# Altium schematic sheet 7_can_rc_i2c_analog.SchDoc: CAN/RCIN/I2C/Analog inputs
size A3; SheetNumber: 7; SheetTotal: 8
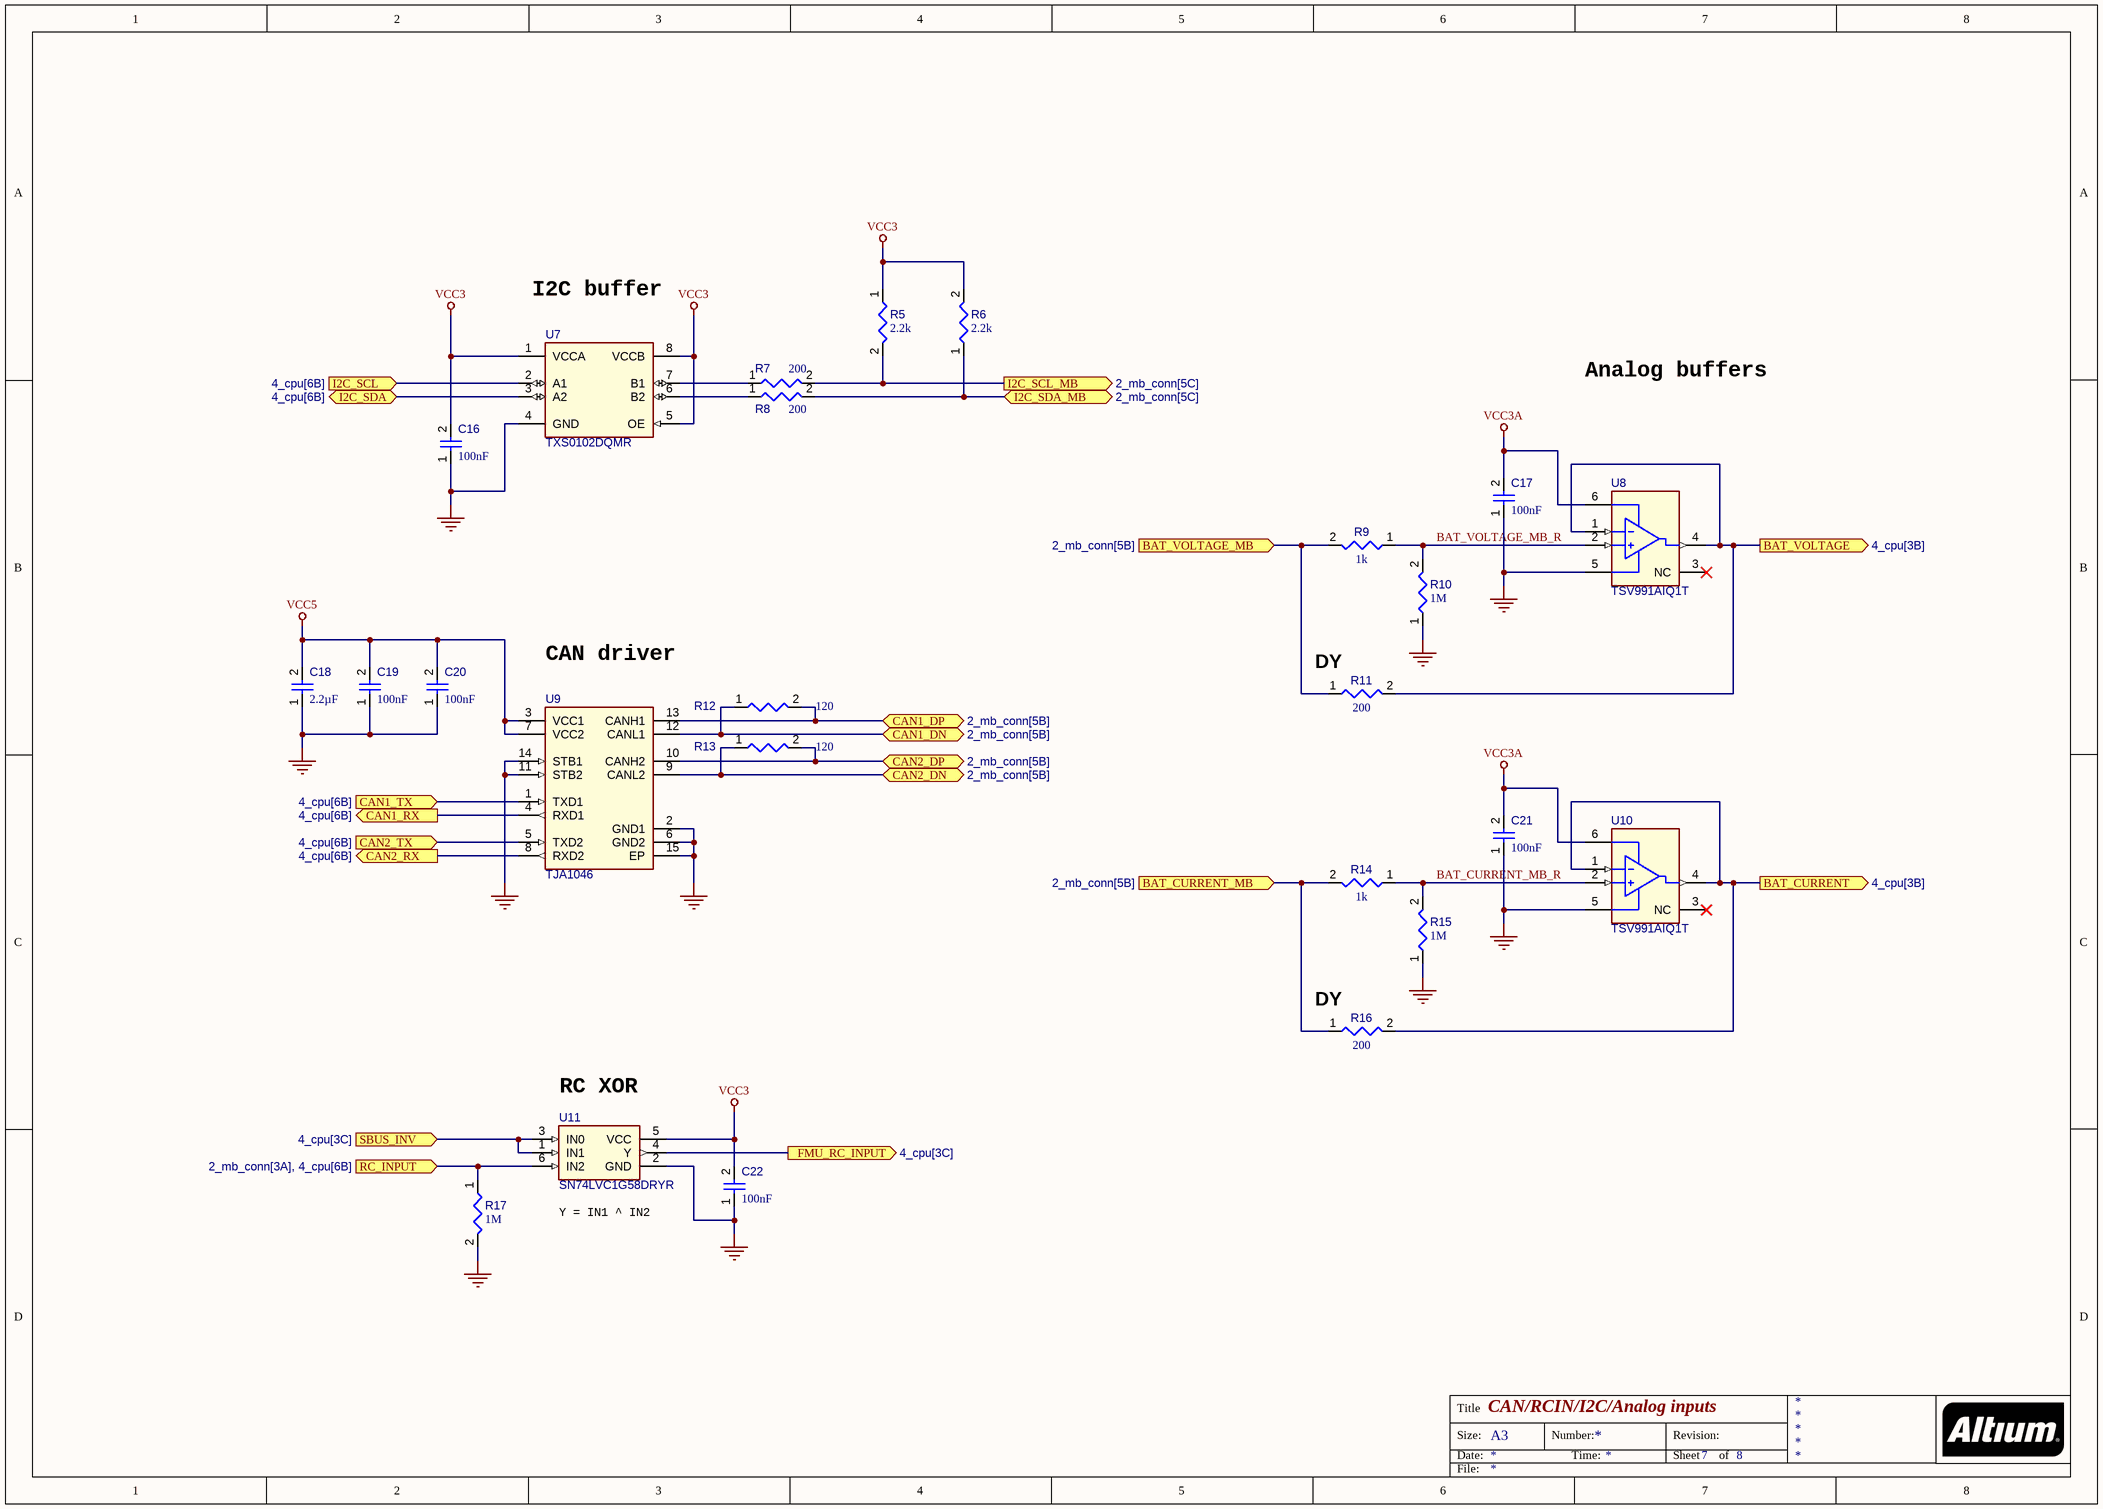
[diagram p0: 7_can_rc_i2c_analog.SchDoc]

## Parts
C16  value 100nF  [CAPC0402(1005)60_L]  (hidden comment: Capacitor 100nF +/-20% 10V 0402)
C17  value 100nF  [CAPC0402(1005)60_L]  (hidden comment: Capacitor 100nF +/-20% 10V 0402)
C18  value 2.2µF  [CAPC0402(1005)60_L]  (hidden comment: Capacitor 2,2µF +/-20% 10V 0402)
C19  value 100nF  [CAPC0402(1005)60_L]  (hidden comment: Capacitor 100nF +/-20% 10V 0402)
C20  value 100nF  [CAPC0402(1005)60_L]  (hidden comment: Capacitor 100nF +/-20% 10V 0402)
C21  value 100nF  [CAPC0402(1005)60_L]  (hidden comment: Capacitor 100nF +/-20% 10V 0402)
C22  value 100nF  [CAPC0402(1005)60_L]  (hidden comment: Capacitor 100nF +/-20% 10V 0402)
R5  value 2.2k  [RESC0402(1005)_L]  (hidden comment: Resistor 2K2  +/-5 % 0402 63 mW)
R6  value 2.2k  [RESC0402(1005)_L]  (hidden comment: Resistor 2K2  +/-5 % 0402 63 mW)
R7  value 200  [RESC0402(1005)_L]  (hidden comment: Resistor 200R +/-5 % 0402 63 mW)
R8  value 200  [RESC0402(1005)_L]  (hidden comment: Resistor 200R +/-5 % 0402 63 mW)
R9  value 1k  [RESC0402(1005)_L]  (hidden comment: Resistor 1K +/-5 % 0402 63 mW)
R10  value 1M  [RESC0402(1005)_L]  (hidden comment: Resistor 1M +/-5 % 0402 63 mW)
R11  value 200  [RESC0402(1005)_L]  (hidden comment: Resistor 200R +/-5 % 0402 63 mW)
R12  value 120  [RESC0603(1608)_L]  (hidden comment: Resistor 120R +/-5 % 0603 0.1 W)
R13  value 120  [RESC0603(1608)_L]  (hidden comment: Resistor 120R +/-5 % 0603 0.1 W)
R14  value 1k  [RESC0402(1005)_L]  (hidden comment: Resistor 1K +/-5 % 0402 63 mW)
R15  value 1M  [RESC0402(1005)_L]  (hidden comment: Resistor 1M +/-5 % 0402 63 mW)
R16  value 200  [RESC0402(1005)_L]  (hidden comment: Resistor 200R +/-5 % 0402 63 mW)
R17  value 1M  [RESC0402(1005)_L]  (hidden comment: Resistor 1M +/-5 % 0402 63 mW)
U7  TXS0102DQMR  [DQM]
U8  TSV991AIQ1T  [STM-DFN-8_V]
U9  TJA1046  [NXP-SOT1086-2_L]
U10  TSV991AIQ1T  [STM-DFN-8_V]
U11  SN74LVC1G58DRYR  [DRY0006A_V]

## Ports
BAT_CURRENT (out, see 4_cpu[3B]), BAT_CURRENT_MB (in, see 2_mb_conn[5B]), BAT_VOLTAGE (out, see 4_cpu[3B]), BAT_VOLTAGE_MB (in, see 2_mb_conn[5B]), CAN1_DN (bidir, see 2_mb_conn[5B]), CAN1_DP (bidir, see 2_mb_conn[5B]), CAN1_RX (out, see 4_cpu[6B]), CAN1_TX (in, see 4_cpu[6B]), CAN2_DN (bidir, see 2_mb_conn[5B]), CAN2_DP (bidir, see 2_mb_conn[5B]), CAN2_RX (out, see 4_cpu[6B]), CAN2_TX (in, see 4_cpu[6B]), FMU_RC_INPUT (out, see 4_cpu[3C]), I2C_SCL (in, see 4_cpu[6B]), I2C_SCL_MB (out, see 2_mb_conn[5C]), I2C_SDA (bidir, see 4_cpu[6B]), I2C_SDA_MB (bidir, see 2_mb_conn[5C]), RC_INPUT (in, see 2_mb_conn[3A], 4_cpu[6B]), SBUS_INV (in, see 4_cpu[3C])

## Nets
GND: C16.1 C17.1 C18.1 C19.1 C20.1 C21.1 C22.1 R10.1 R15.1 R17.2 U7.4(GND) U8.5(VCC-) U9.2(GND1) U9.6(GND2) U9.11(STB2) U9.14(STB1) U9.15(EP) U10.5(VCC-) U11.2(GND)
VCC3: C16.2 C22.2 R5.1 R6.2 U7.1(VCCA) U7.5(OE) U7.8(VCCB) U11.5(VCC)
VCC3A: C17.2 C21.2 U8.6(VCC+) U10.6(VCC+)
VCC5: C18.2 C19.2 C20.2 U9.3(VCC1) U9.7(VCC2)
BAT_CURRENT: R16.2 U10.1(IN-) U10.4(OUT) ; port BAT_CURRENT
BAT_CURRENT_MB: R14.2 R16.1 ; port BAT_CURRENT_MB
BAT_CURRENT_MB_R: R14.1 R15.2 U10.2(IN+)
BAT_VOLTAGE: R11.2 U8.1(IN-) U8.4(OUT) ; port BAT_VOLTAGE
BAT_VOLTAGE_MB: R9.2 R11.1 ; port BAT_VOLTAGE_MB
BAT_VOLTAGE_MB_R: R9.1 R10.2 U8.2(IN+)
CAN1_DN: R12.1 U9.12(CANL1) ; port CAN1_DN
CAN1_DP: R12.2 U9.13(CANH1) ; port CAN1_DP
CAN1_RX: U9.4(RXD1) ; port CAN1_RX
CAN1_TX: U9.1(TXD1) ; port CAN1_TX
CAN2_DN: R13.1 U9.9(CANL2) ; port CAN2_DN
CAN2_DP: R13.2 U9.10(CANH2) ; port CAN2_DP
CAN2_RX: U9.8(RXD2) ; port CAN2_RX
CAN2_TX: U9.5(TXD2) ; port CAN2_TX
FMU_RC_INPUT: U11.4(Y) ; port FMU_RC_INPUT
I2C_SCL: U7.2(A1) ; port I2C_SCL
I2C_SCL_MB: R5.2 R7.2 ; port I2C_SCL_MB
I2C_SDA: U7.3(A2) ; port I2C_SDA
I2C_SDA_MB: R6.1 R8.2 ; port I2C_SDA_MB
RC_INPUT: R17.1 U11.6(IN2) ; port RC_INPUT
SBUS_INV: U11.1(IN1) U11.3(IN0) ; port SBUS_INV
NetR7_1: R7.1 U7.7(B1)
NetR8_1: R8.1 U7.6(B2)

Not connected (* = marked no-connect by the designer): U8 3(NC)*; U10 3(NC)*

## Notes on the sheet
- I2C buffer
- Analog buffers
- CAN driver
- (near R11) DY
- (near R16) DY
- (near U11) RC XOR
- (near U11) Y = IN1 ^ IN2
- Title
- Size:
- Date:
- A3
- Number:
- Time:
- Revision:
- Sheet
- of
- File:

## Library data of the parts
C16 C17 C19-C22 = CMP-001-00061-9: Chip Capacitor, 100nF +/-20%, 10V, 0402, Thickness 0.6 mm; Manufacturer 1: KEMET; Manufacturer Lifecycle 1: Volume Production; Manufacturer Part Number 1: C0402C104K8RACTU; Tolerance: 20%; Moeda: USD; Preço: 1: 0.013; Preço: 10: 3.38; Preço:100: 28.6; Preço:1000: 130; Case/Package: 0402; Min Operating Temperature: -55°C; Mounting Technology: SMT; Max Operating Temperature: 85°C; Pins: 2; Voltage Rating: 10V; Imagem: https://sigma.octopart.com/cdn-cgi/image/width=75,fit=contain,quality=85,format=auto/10190940/image/Kemet-C0402C104K8RACTU.jpg; Quantity: 26
C18 = CMP-001-00056-9: Chip Capacitor, 2,2µF +/-20%, 10V, 0402, Thickness 0.6 mm; Manufacturer 1: Murata; Manufacturer Lifecycle 1: Volume Production; Manufacturer Part Number 1: GRM155R61C225KE44D; Tolerance: 10%; Moeda: USD; Preço: 1: 0.051; Preço: 10: 5.1; Preço:100: 35.7; Preço:1000: 273; Case/Package: 0603; Voltage Rating: 10V; Mounting Technology: SMT; Min Operating Temperature: -55°C; Max Operating Temperature: 85°C; Pins: 2; Imagem: https://search.murata.co.jp/Ceramy/image/img/A01X/KGJ4.png; Quantity: 27
R5 R6 = CMP-009-00166-3: Chip Resistor, 2,2 kOhms, +/-5 %, 63 mW, -55 to 155 degC, 0402; Manufacturer 1: Bourns; Manufacturer Lifecycle 1: Volume Production; Manufacturer Part Number 1: CR0402-JW-222GLF; Power: 63mW; Tolerance: 5%; __ORIG_LIFECYCLESTATEGUID__: 706004B5-C76E-482E-903B-BA0E4FAE086A; Moeda: USD; Preço: 1: 0.005; Preço: 10: 0.1; Preço:100: 0.4; Preço:1000: 2.5; Case/Package: 0402; Max Operating Temperature: 155°C; Min Operating Temperature: -55°C; Pins: 2; Quantity: 762
R7 R8 R11 R16 = CMP-009-00161-3: Chip Resistor, 200 Ohms, +/-5 %, 63 mW, -55 to 155 degC, 0402; Manufacturer 1: Bourns; Manufacturer Lifecycle 1: Volume Production; Manufacturer Part Number 1: CR0402-JW-201GLF; Power: 63mW; Tolerance: 5%; __ORIG_LIFECYCLESTATEGUID__: 706004B5-C76E-482E-903B-BA0E4FAE086A; Moeda: USD; Preço: 1: 0.005; Preço: 10: 0.2; Preço:100: 1.5; Preço:1000: 4; Case/Package: 0402; Max Operating Temperature: 155°C; Min Operating Temperature: -55°C; Pins: 2; Quantity: 2324
R9 R14 = CMP-009-00157-3: Chip Resistor, 1 kOhms, +/-5 %, 63 mW, -55 to 155 degC, 0402; Manufacturer 1: Yageo; Manufacturer Lifecycle 1: Volume Production; Manufacturer Part Number 1: RC0402JR-071KL; Tolerance: 5%; Power: 63mW; __ORIG_LIFECYCLESTATEGUID__: 706004B5-C76E-482E-903B-BA0E4FAE086A; Moeda: USD; Preço: 1: 0.011; Preço: 10: 0.44; Preço:100: 2.4; Preço:1000: 16; Case/Package: 0402; Max Operating Temperature: 155°C; Min Operating Temperature: -55°C; Pins: 2; Quantity: 23
R10 R15 R17 = CMP-009-00151-3: Chip Resistor, 1 MOhms, +/-5 %, 63 mW, -55 to 155 degC, 0402; Manufacturer 1: Bourns; Manufacturer Lifecycle 1: Volume Production; Manufacturer Part Number 1: CR0402-JW-105GLF; Tolerance: 5%; Power: 63mW; __ORIG_LIFECYCLESTATEGUID__: 706004B5-C76E-482E-903B-BA0E4FAE086A; Moeda: USD; Preço: 1: 0.006; Preço: 10: 0.24; Preço:100: 1.6; Preço:1000: 8; Case/Package: 0402; Max Operating Temperature: 155°C; Min Operating Temperature: -55°C; Pins: 2; Quantity: 534
R12 R13 = CMP-009-00176-3: Chip Resistor, 120 Ohms, +/-5 %, 0.1 W, -55 to 155 degC, 0603; Manufacturer 1: Bourns; Manufacturer Lifecycle 1: Volume Production; Manufacturer Part Number 1: CR0603-JW-121ELF; Tolerance: 5%; Power: 100mW; __ORIG_LIFECYCLESTATEGUID__: 706004B5-C76E-482E-903B-BA0E4FAE086A; Moeda: USD; Preço: 1: 0.007; Preço: 10: 0.14; Preço:100: 1; Preço:1000: 8; Case/Package: 0603; Max Operating Temperature: 155°C; Min Operating Temperature: -55°C; Pins: 2; Quantity: 642
U7 = CMP-015-00002-2: IC TRANSLATOR VOLTAGE 8-X2SON; Manufacturer 1: Texas Instruments; Manufacturer Lifecycle 1: Volume Production; Max Supply Voltage: 5.5V; Min Supply Voltage: 1.65V; Moeda: USD; Preço: 1: 0.721; Preço: 10: 7.21; Preço:100: 55.3; Preço:1000: 380; Max Operating Temperature: 85°C; Min Operating Temperature: -40°C; Pins: 8; Manufacturer Part Number 1: TXS0102DQMR; Quantity: 61
U8 U10 = CMP-014-00000-8: Rail-to-rail Input / Output GBP Operational Amplifier, 20 MHz, -40 to 125 degC, 6-Pin DFN, RoHS, Tape and Reel; Manufacturer 1: STMicroelectronics; Manufacturer Lifecycle 1: Volume Production; Channels: 2; Moeda: USD; Preço: 1: 0.965; Preço: 10: 19.3; Preço:100: 148.2; Preço:1000: 1034; Min Operating Temperature: -40°C; Max Operating Temperature: 125°C; Pins: 6; atributo: =value+' '+voltage; FUNCIONAMENTO: =value+' '+"Voltage Rating"; Manufacturer Part Number 1: TSV991AIQ1T; Quantity: 131; TESTE: =value+' '+tensao
U9 = CMP-015-00005-3: Dual High-speed CAN Transceiver with Standby Mode, 4.75 to 5.25 V, 14-Pin HVSON, RoHS, Tape and Reel; Manufacturer 1: NXP Semiconductors; Manufacturer Lifecycle 1: Volume Production; Manufacturer Part Number 1: TJA1046TKZ; Moeda: USD; Preço: 1: 2.41; Preço: 10: 24.1; Preço:100: 205; Preço:1000: 1400; Pins: 15; Quantity: 186
U11 = CMP-031-00001-2: CONFIGURABLE MULTIPLE-FUNCTION GATE, DRY0006A, LARGE T&R; Local ID: 84F2; Pins: 6